# Altium project 11-10030__sot23-5-op-amp-proto__A.PrjPcb
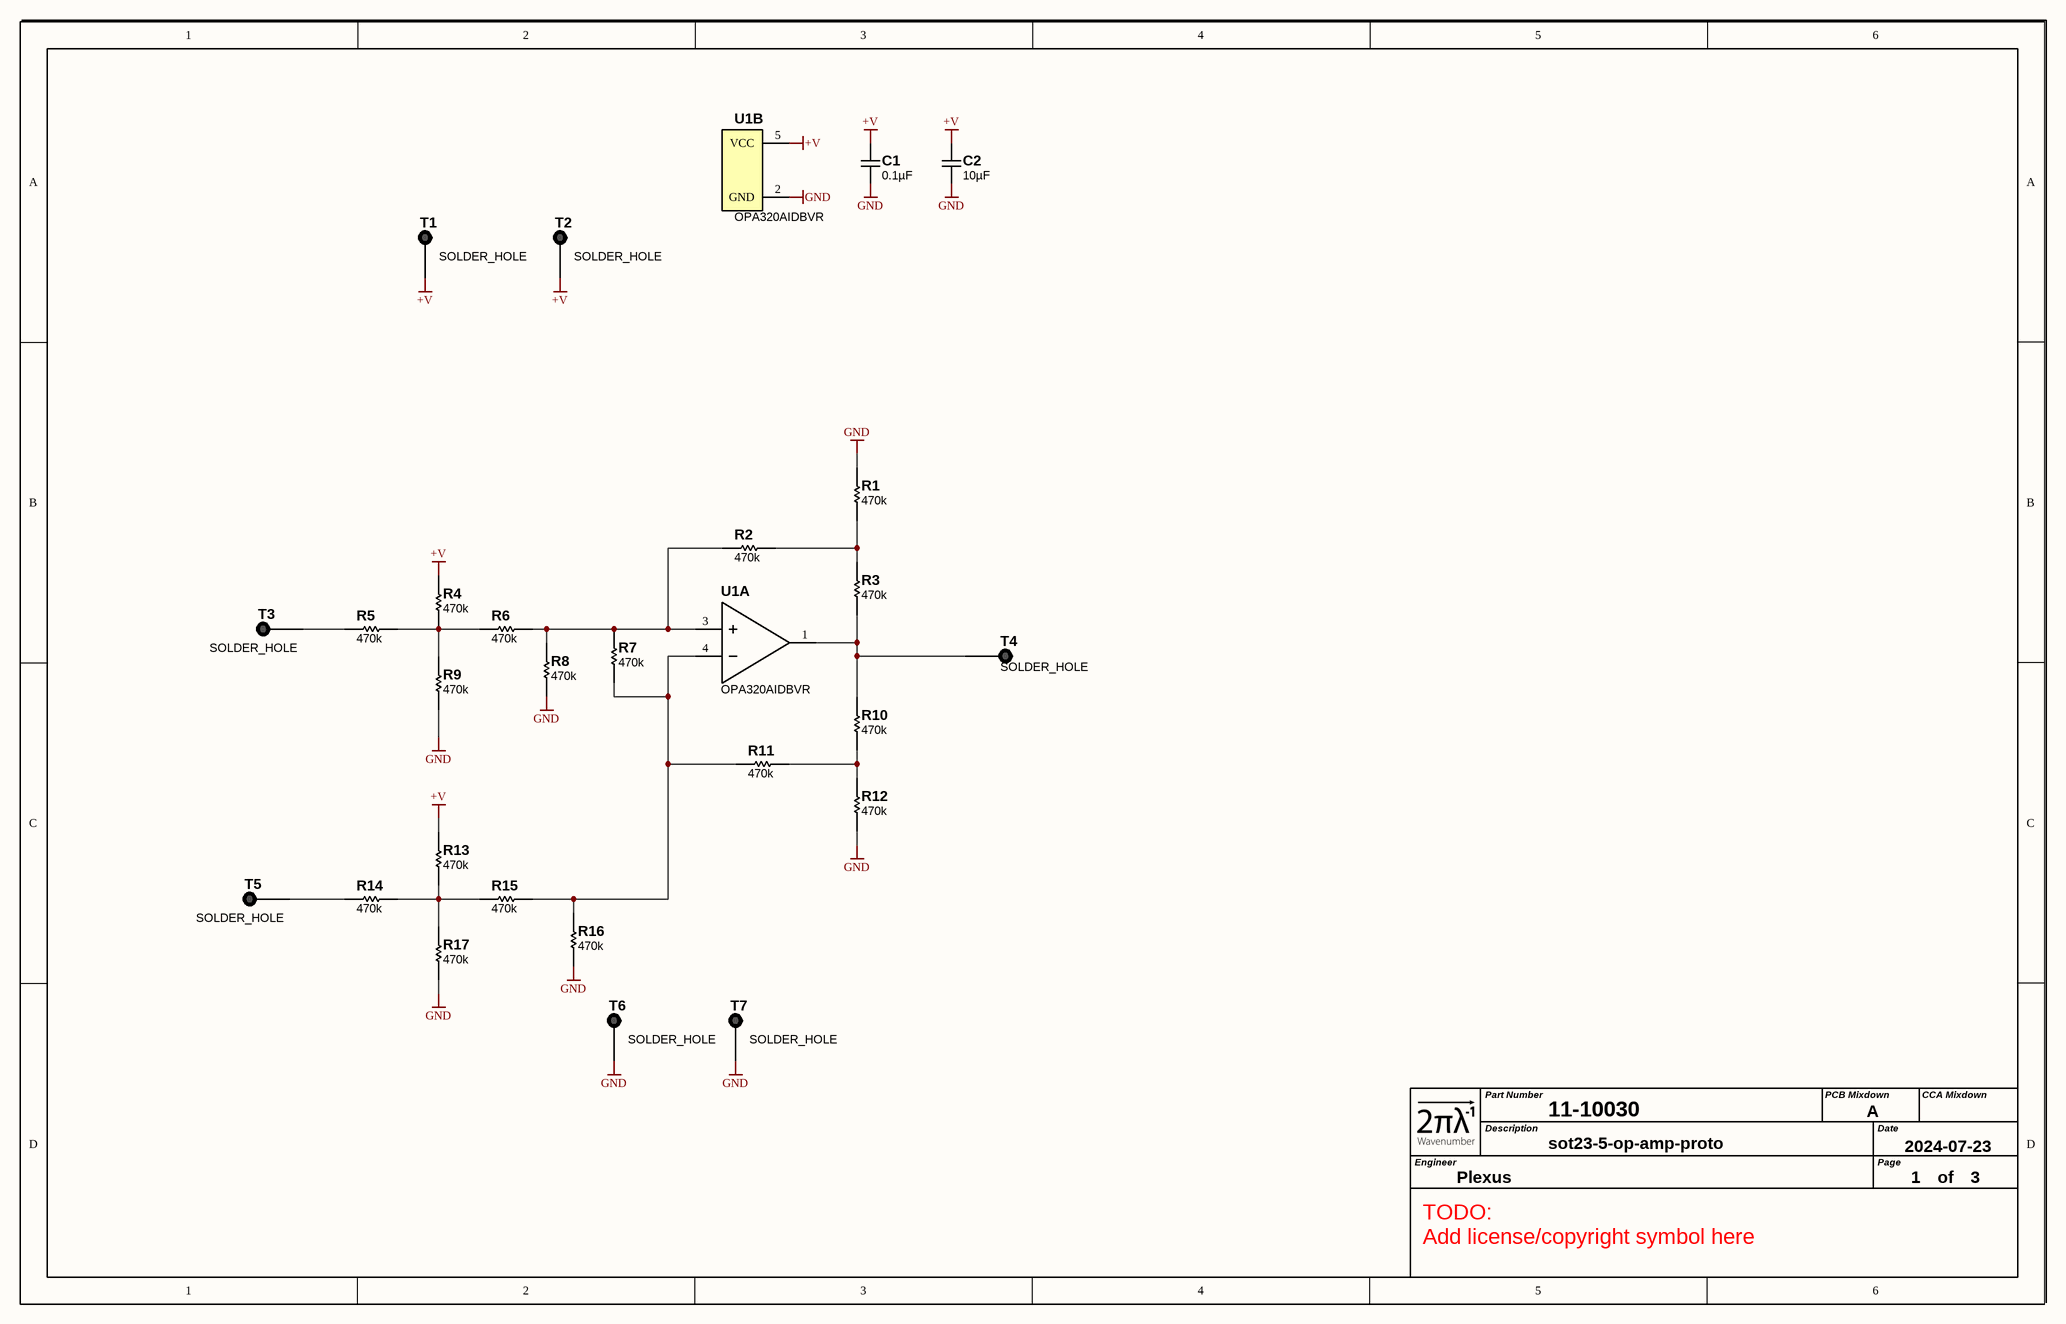
[diagram p0: sot23-5-op-amp-proto__TOP_LEVEL__A.SchDoc]
CCA_CODENAME: sot23-5-op-amp-proto; CCA_DESCRIPTION: sot23-5-op-amp-proto; CCA_PART_NUMBER: 10-10030; CCA_TITLE: sot23-5-op-amp-proto; ENGINEER: Plexus; PCB_CODENAME: sot23-5-op-amp-proto; PCB_DATE: 2024-07-23; PCB_DESCRIPTION: sot23-5-op-amp-proto; PCB_MIXDOWN: A; PCB_PART_NUMBER: 11-10030; SCH_DATE: 2024-07-23; STATUS: PROTOTYPE
1 sheet, 27 parts. Net scope: global (net labels, ports and power ports of the same name join across sheets).
Board file: sot23-5-op-amp-proto__A.PcbDoc

## Sheet sot23-5-op-amp-proto__TOP_LEVEL__A.SchDoc
size B; Organization: Altium Limited; Address1: 3 Minna Close; Address2: Belrose; Address3: NSW 2085; Address4: Australia; SheetNumber: 1; SheetTotal: 3; PAGE_TITLE: -

### Parts
C1  0.1µF  [C0603_0.90MM_MD]
C2  10µF  [C0805_1.40MM_MD]
R1  470k  [R0603_0.55MM_MD]
R2  470k  [R0603_0.55MM_MD]
R3  470k  [R0603_0.55MM_MD]
R4  470k  [R0603_0.55MM_MD]
R5  470k  [R0603_0.55MM_MD]
R6  470k  [R0603_0.55MM_MD]
R7  470k  [R0603_0.55MM_MD]
R8  470k  [R0603_0.55MM_MD]
R9  470k  [R0603_0.55MM_MD]
R10  470k  [R0603_0.55MM_MD]
R11  470k  [R0603_0.55MM_MD]
R12  470k  [R0603_0.55MM_MD]
R13  470k  [R0603_0.55MM_MD]
R14  470k  [R0603_0.55MM_MD]
R15  470k  [R0603_0.55MM_MD]
R16  470k  [R0603_0.55MM_MD]
R17  470k  [R0603_0.55MM_MD]
T1  SOLDER_HOLE  [SOLDER_HOLE -  22AWG]  (no BOM)
T2  SOLDER_HOLE  [SOLDER_HOLE -  22AWG]  (no BOM)
T3  SOLDER_HOLE  [SOLDER_HOLE -  24AWG]  (no BOM)
T4  SOLDER_HOLE  [SOLDER_HOLE -  22AWG]  (no BOM)
T5  SOLDER_HOLE  [SOLDER_HOLE -  24AWG]  (no BOM)
T6  SOLDER_HOLE  [SOLDER_HOLE -  22AWG]  (no BOM)
T7  SOLDER_HOLE  [SOLDER_HOLE -  22AWG]  (no BOM)
U1  OPA320AIDBVR  [SOT23-5]  (parts A,B of 2)

### Nets
+V: C1.2 C2.2 R4.2 R13.2 T1.1 T2.1 U1.5(VCC)
GND: C1.1 C2.1 R1.2 R8.1 R9.1 R12.1 R16.1 R17.1 T6.1 T7.1 U1.2(GND)
NetR1_1: R1.1 R2.1 R3.2
NetR2_2: R2.2 R6.1 R7.2 R8.2 U1.3(+)
NetR3_1: R3.1 R10.2 T4.1 U1.1(OUT)
NetR4_1: R4.1 R5.1 R6.2 R9.2
NetR5_2: R5.2 T3.1
NetR7_1: R7.1 R11.2 R15.1 R16.2 U1.4(-)
NetR10_1: R10.1 R11.1 R12.2
NetR13_1: R13.1 R14.1 R15.2 R17.2
NetR14_2: R14.2 T5.1

### Notes on the sheet
- TODO:
  Add license/copyright symbol here
- Part Number
- PCB Mixdown
- CCA Mixdown
- Engineer
- Description
- Date
- Page
- of

### Library data of the parts
C1 = GCJ188R71C104KA01D: CAP CER 0.1UF 16V X7R 0603; Manufacturer: Murata Electronics; Tolerance: ±10%; Substitution Notes: 0.1µF , 16V , ±10% , X7R , -55°C ~ 125°C , AEC-Q200 , 0603; Value: 0.1µF; Temperature Coefficient: X7R; Manufacturer Part Number: GCJ188R71C104KA01D; ComponentLink1Description: Datasheet (Internal); ComponentLink1URL: https://www.murata.com/~/media/webrenewal/support/library/catalog/products/capacitor/mlcc/c03e.ashx?la=en-us; ComponentLink2Description: Datasheet (External); ComponentLink2URL: https://www.murata.com/~/media/webrenewal/support/library/catalog/products/capacitor/mlcc/c03e.ashx?la=en-us; Supplier 1: Digikey; Supplier Part Number 1: 490-5796-1-ND; Category: Capacitors; Voltage - Rated: 16V; Operating Temperature: -55°C ~ 125°C; Ratings: AEC-Q200; Package: 0603; Thickness (Max): 0.90MM
C2 = GCM21BR71A106KE22K: CAP CER 10UF 10V X7R 0805; Manufacturer: Murata Electronics; Tolerance: ±10%; Substitution Notes: 10µF , 10V , ±10% , X7R , -55°C ~ 125°C , AEC-Q200 , 0805; Value: 10µF; Temperature Coefficient: X7R; Manufacturer Part Number: GCM21BR71A106KE22K; ComponentLink1Description: Datasheet (Internal); ComponentLink1URL: https://search.murata.co.jp/Ceramy/image/img/A01X/G101/ENG/GCM21BR71A106KE22-01.pdf; ComponentLink2Description: Datasheet (External); ComponentLink2URL: https://search.murata.co.jp/Ceramy/image/img/A01X/G101/ENG/GCM21BR71A106KE22-01.pdf; Supplier 1: Digikey; Supplier Part Number 1: 490-14531-1-ND; Category: Capacitors; Voltage - Rated: 10V; Operating Temperature: -55°C ~ 125°C; Ratings: AEC-Q200; Package: 0805; Thickness (Max): 1.40MM
R1-R17 = ERJ-3EKF4703V: RES 470K OHM 1/10W 1% 0603 SMD; Manufacturer: Panasonic Electronic Components; Package Power: 0603  (0.1W); Power (Watts): 0.1W- 1/10W; Temperature Coefficient: ±100ppm/°C; Limiting Element Voltage: 75; Maximum Overload Voltage: 150; Maximum Working Voltage: 75.0V; Substitution Notes: 470k , ±1% , 0603 , AEC-Q200; Value: 470k; Manufacturer Part Number: ERJ-3EKF4703V; ComponentLink1Description: Internal Datasheet; ComponentLink1URL: datasheets\Panasonic Electronic Components\AOA0000CE2.pdf; ComponentLink2Description: External Datasheet; ComponentLink2URL: http://industrial.panasonic.com/www-data/pdf/AOA0000/AOA0000CE2.pdf; Supplier 1: Digi-Key; Supplier Part Number 1: P470KHCT-ND; Category: Resistors; Resistance (Ohms): 470k; Composition: Thick Film; Features: -; Tolerance: ±1%; Package: 0603 (1608 Metric); Supplier Package: 0603; Size / Dimension: 0.063" L x 0.031" W (1.60mm x 0.80mm); Height: 0.55MM; Number of Terminations: 2; Packaging: Cut Tape (CT); Sort Value: 470000; Sort Value Package: 603_470000; Ratings: AEC-Q200
T1-T7 = SOLDER_HOLE: A Generic Hole for attaching flying leads
U1 = OPA320AIDBVR: IC OPAMP GP 20MHZ RRO SOT23-5; Manufacturer: Texas Instruments; Amplifier Type: General Purpose; Output Type: Rail-to-Rail; Slew Rate: 10 V/µs; Current - Supply: 1.5mA; Voltage - Supply, Single/Dual (±): 1.8 V ~ 5.5 V, ±0.9 V ~ 2.75 V; Value: OPA320AIDBVR; Supplier 1: Digi-Key; Supplier Part Number 1: 296-29480-1-ND; Manufacturer Part Number: OPA320AIDBVR; RoHS: RoHS Compliant; Category: Integrated Circuits (ICs); Stock 1: 11262; Pricing 1: 1=2.19, 10=1.965, 100=1.5796, 500=1.2978, 1000=1.07532 (USD); Packaging: Cut Tape (CT); Part Status: Active; Operating Temperature: -40°C ~ 125°C; Mounting Type: Surface Mount; Package / Case: SC-74A, SOT-753; Supplier Device Package: SOT-23-5; ComponentLink1URL: http://www.ti.com/lit/ds/symlink/opa320.pdf; ComponentLink1Description: http://www.ti.com/lit/ds/symlink/opa320.pdf

## Assembly variants
A: all parts fitted